# Altium project DC-DC_10-40V_8A.PrjPcb
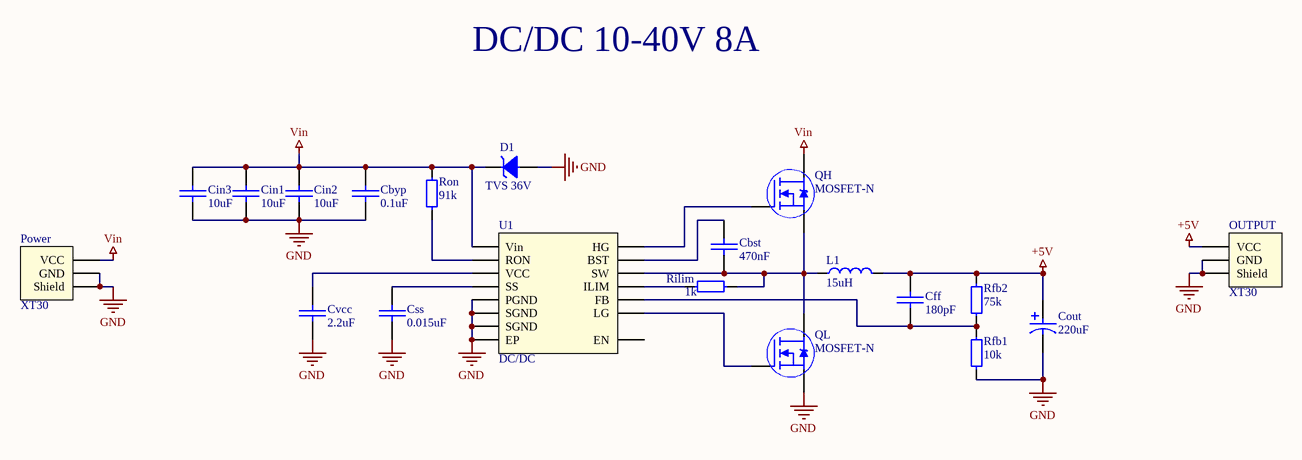
[diagram p0: DC-DC_10-40V_8A.SchDoc]
1 sheet, 20 parts. Net scope: global (net labels, ports and power ports of the same name join across sheets).
Board file: DC-DC_10-40V_8A.PcbDoc

## Sheet DC-DC_10-40V_8A.SchDoc
size A4

### Parts
Cbst  470nF  [0603 Capicator]
Cbyp  0.1uF  [0603 Capicator]
Cff  180pF  [0603 Capicator]
Cin1  10uF  [0603 Capicator]
Cin2  10uF  [0603 Capicator]
Cin3  10uF  [0603 Capicator]
Cout  220uF  [Bar Cap 6.3x7.7]
Css  0.015uF  [0603 Capicator]
Cvcc  2.2uF  [0603 Capicator]
D1  TVS 36V  [SMB]
L1  15uH  [Inductor 12.8 x 12.8 x 8.0]
OUTPUT  XT30  [HEADER 2 XT30PW FeMale]
Power  XT30  [HEADER 2 XT30PW Male]
QH  MOSFET-N  [VSON]
QL  MOSFET-N  [VSON]
Rfb1  10k  [0603 Resistor]
Rfb2  75k  [0603 Resistor]
Rilim  1k  [0603 Resistor]
Ron  91k  [0603 Resistor]
U1  DC/DC  [HTSSOP-14]

### Nets
+5V: Cff.2 Cout.2 L1.2 OUTPUT.2(VCC) Rfb2.2
GND: Cbyp.2 Cin1.1 Cin2.1 Cin3.1 Cout.1 Css.1 Cvcc.2 D1.1 OUTPUT.1(GND) OUTPUT.A(Shield) Power.2(GND) Power.A(Shield) QL.3(Sourse) Rfb1.1 U1.5(SGND) U1.9(SGND) U1.14(PGND) U1.A(EP)
Vin: Cbyp.1 Cin1.2 Cin2.2 Cin3.2 D1.2 Power.1(VCC) QH.2(Drain) Ron.2 U1.2(Vin)
NetCbst_1: Cbst.1 L1.1 QH.3(Sourse) QL.2(Drain) Rilim.2 U1.10(SW)
NetCbst_2: Cbst.2 U1.12(BST)
NetCff_1: Cff.1 Rfb1.2 Rfb2.1 U1.4(FB)
NetCss_2: Css.2 U1.6(SS)
NetCvcc_1: Cvcc.1 U1.1(VCC)
NetQH_1: QH.1(Gate) U1.11(HG)
NetQL_1: QL.1(Gate) U1.13(LG)
NetRilim_1: Rilim.1 U1.8(ILIM)
NetRon_1: Ron.1 U1.7(RON)

Not connected (* = marked no-connect by the designer): U1 3(EN)

### Notes on the sheet
- DC/DC 10-40V 8A

### Library data of the parts
Cbst = Cap 470nF (0603): 470nF X7R 25V 10% 0603; Manufacturer: Murata Manufacturing; Part Number: GRM188R71E474KA12D; Type: Capacitor; ComponentLink1Description: Chip&Dip; ComponentLink1URL: https://www.chipdip.ru/product/grm188r71e474ka12d
Cbyp = Cap 0.1uF (0603): 0.1uF X7R 50V 10% 0603; Manufacturer: Murata Manufacturing; Part Number: GRM188R71H104KA93D; Type: Capacitor; ComponentLink1Description: Chip&Dip; ComponentLink1URL: https://www.chipdip.ru/product/grm188r71h104k
Cff = Cap 180pF (0603): 180pF NP0 50V 5% 0603; Manufacturer: Murata Manufacturing; Part Number: GRM1885C1H181JA01D; Type: Capacitor; ComponentLink1Description: Chip&Dip; ComponentLink1URL: https://www.chipdip.ru/product/grm1885c1h181j
Cin1-Cin3 = Cap 10uF (0603): 10uF X5R 25V 20% 0603; Manufacturer: Murata Manufacturing; Part Number: GRM188R61E106M; Type: Capacitor; ComponentLink1Description: Chip&Dip; ComponentLink1URL: https://www.chipdip.ru/product/grm188r61e106m
Cout = Cap Pol 220uF: ECAP SMD,  10V, 105°C, 20%; Part Number: JCK1A221M063077; Manufacturer: JB; Type: Capacitor; ComponentLink1Description: Chip&Dip; ComponentLink1URL: https://www.chipdip.ru/product0/9000565740
Css = Cap 0.015uF (0603): 0.015uF X7R 50V 10% 0603; Manufacturer: Taiwan; Part Number: MLCC0.015uFX7R50V10%0603; Type: Capacitor; ComponentLink1Description: Chip&Dip; ComponentLink1URL: https://www.chipdip.ru/product0/895412441
Cvcc = Cap 2.2uF (0603): 2.2uF X5R 10V 10% 0603; Manufacturer: Murata Manufacturing; Part Number: GRM188R61A225KE34D; Type: Capacitor; ComponentLink1Description: Chip&Dip; ComponentLink1URL: https://www.chipdip.ru/product/grm188r61a225k
D1 = TVS Diode 36V (SMB): [SMB / DO-214AA], 600W; Part Number: SMBJ36CA-TR; Manufacturer: ST Microelectronics; Type: Diode; ComponentLink1Description: DataSheet; ComponentLink1URL: https://static6.arrow.com/aropdfconversion/ee4838c0939fd68177ef9747b63ca424c7b9f39b/519651672847221cd0000.pdf; ComponentLink2Description: Chip&Dip; ComponentLink2URL: https://www.chipdip.ru/product/smbj36ca
L1 = Inductor 15uH (4.5A): [B82477G4153M], 15uH, 12.8x12.8, 4.5A; Manufacturer: Epcos; Type: Inductor; ComponentLink1Description: DataSheet; ComponentLink1URL: https://static.chipdip.ru/lib/009/DOC001009882.pdf; ComponentLink2Description: Chip&Dip; ComponentLink2URL: https://www.chipdip.ru/product/b82477g4153m; Part Number: B82477G4153M
OUTPUT = Conn2x1 [XT30PW-Female]: Part Number: XT30PW; Manufacturer: Amass; ComponentLink1Description: AliExpress; ComponentLink1URL: https://ru.aliexpress.com/item/4000070113352.html?spm=a2g0o.productlist.0.0.39dd34bfyYuspa&algo_pvid=4d7d83f5-6270-4220-b100-9b5f13b0846d&algo_expid=4d7d83f5-6270-4220-b100-9b5f13b0846d-3&btsid=c67bc929-e3be-4af3-9fd9-25ac13ce4818&ws_ab_test=searchweb0_0,searchweb201602_,searchweb201603_55; Type: Connector
Power = Conn2x1 [XT30PW-Male]: Part Number: XT30PW; Manufacturer: Amass; ComponentLink1Description: AliExpress; ComponentLink1URL: https://ru.aliexpress.com/item/4000070113352.html?spm=a2g0o.productlist.0.0.39dd34bfyYuspa&algo_pvid=4d7d83f5-6270-4220-b100-9b5f13b0846d&algo_expid=4d7d83f5-6270-4220-b100-9b5f13b0846d-3&btsid=c67bc929-e3be-4af3-9fd9-25ac13ce4818&ws_ab_test=searchweb0_0,searchweb201602_,searchweb201603_55; Type: Connector
QH QL = MOSFET-N [CSD]: [CSD19534Q5AT]. NexFET™ N-channel Power MOSFET designed to minimize losses in power conversion applications; Manufacturer: Texas Instruments; Type: Transistor; Part Number: CSD19534Q5A; ComponentLink1Description: DataSheet; ComponentLink1URL: http://www.ti.com/lit/ds/symlink/csd19534q5a.pdf; ComponentLink2Description: Chip&Dip; ComponentLink2URL: https://www.chipdip.ru/product/csd19534q5at
Rfb1 = Res 10k (0603): 0.1W 0603 10k, 1%; Part Number: RC0603FR-0710KL; Manufacturer: Taiwan; Type: Resistor; ComponentLink1Description: Chip&Dip; ComponentLink1URL: https://www.chipdip.ru/product0/9000079736
Rfb2 = Res 75k (0603): 0.1W 0603 75k, 1%; Part Number: RC0603FR-0775KL; Manufacturer: Taiwan; Type: Resistor; ComponentLink1Description: Chip&Dip; ComponentLink1URL: https://www.chipdip.ru/product0/9000079757
Rilim = Res 1k (0603): 0.1W 0603 1k, 1%; Part Number: RC0603FR-071KL; Manufacturer: Taiwan; Type: Resistor; ComponentLink1Description: Chip&Dip; ComponentLink1URL: https://www.chipdip.ru/product0/9000079676
Ron = Res 91k (0603): 0.1W 0603 91k, 1%; Part Number: RC0603FR-0791KL; Manufacturer: Taiwan; Type: Resistor; ComponentLink1Description: Chip&Dip; ComponentLink1URL: https://www.chipdip.ru/product0/9000079759
U1 = DC/DC Controller [LM3150]: The [LM3150MH/NOPB] is a SIMPLE SWITCHER® synchronous Step-down Controller capable of providing up to 12A of output current in a typical application. Operating with an input voltage range of 6V to 42V, the LM3150 features an adjustable output voltage down to 0.6V; Manufacturer: Texas Instruments; ComponentLink1Description: Chip&Dip; ComponentLink1URL: https://www.chipdip.ru/product/lm3150mh-nopb; ComponentLink2Description: DataSheet; ComponentLink2URL: https://static.chipdip.ru/lib/029/DOC001029258.pdf; PartNumber: LM3150MH/NOPB